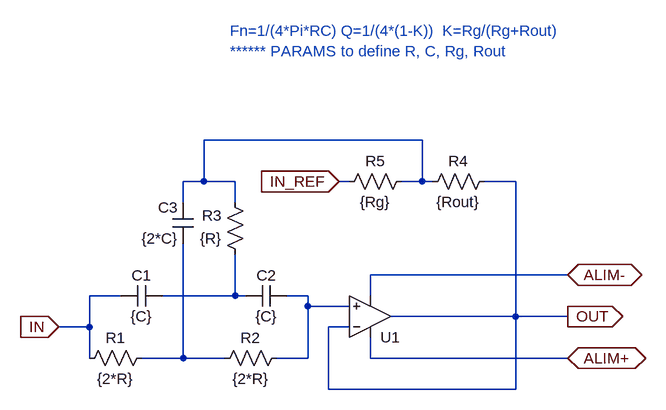
[diagram p0: schematic band-rejectTwinT-SUB.asc]
band-rejectTwinT-SUB.asc, the LTspice schematic file:
Version 4
SHEET 1 880 680
WIRE 160 -160 -176 -160
WIRE -176 -96 -176 -160
WIRE -176 -96 -208 -96
WIRE -128 -96 -176 -96
WIRE 48 -96 32 -96
WIRE 160 -96 160 -160
WIRE 160 -96 128 -96
WIRE 176 -96 160 -96
WIRE 304 -96 256 -96
WIRE -208 -64 -208 -96
WIRE -128 -64 -128 -96
WIRE 384 48 80 48
WIRE -304 80 -352 80
WIRE -128 80 -128 16
WIRE -128 80 -240 80
WIRE -112 80 -128 80
WIRE -16 80 -48 80
WIRE 80 80 80 48
WIRE -16 96 -16 80
WIRE 48 96 -16 96
WIRE 304 112 304 -96
WIRE 304 112 112 112
WIRE 384 112 304 112
WIRE -352 128 -352 80
WIRE -352 128 -400 128
WIRE 48 128 16 128
WIRE -352 176 -352 128
WIRE -208 176 -208 0
WIRE -208 176 -272 176
WIRE -144 176 -208 176
WIRE -16 176 -16 96
WIRE -16 176 -64 176
WIRE 80 176 80 144
WIRE 384 176 80 176
WIRE 16 224 16 128
WIRE 304 224 304 112
WIRE 304 224 16 224
FLAG 32 -96 IN_REF
IOPIN 32 -96 In
FLAG -400 128 IN
IOPIN -400 128 In
FLAG 384 48 ALIM-
IOPIN 384 48 BiDir
FLAG 384 112 OUT
IOPIN 384 112 Out
FLAG 384 176 ALIM+
IOPIN 384 176 BiDir
SYMBOL cap -240 64 R90
WINDOW 0 0 32 VBottom 2
WINDOW 3 32 32 VTop 2
SYMATTR InstName C1
SYMATTR Value {C}
SYMBOL cap -48 64 R90
WINDOW 0 0 32 VBottom 2
WINDOW 3 32 32 VTop 2
SYMATTR InstName C2
SYMATTR Value {C}
SYMBOL cap -192 0 R180
WINDOW 0 24 56 Left 2
WINDOW 3 24 8 Left 2
SYMATTR InstName C3
SYMATTR Value {2*C}
SYMBOL res -256 160 R90
WINDOW 0 0 56 VBottom 2
WINDOW 3 32 56 VTop 2
SYMATTR InstName R1
SYMATTR Value {2*R}
SYMBOL res -48 160 R90
WINDOW 0 0 56 VBottom 2
WINDOW 3 32 56 VTop 2
SYMATTR InstName R2
SYMATTR Value {2*R}
SYMBOL res -112 32 R180
WINDOW 0 36 76 Left 2
WINDOW 3 36 40 Left 2
SYMATTR InstName R3
SYMATTR Value {R}
SYMBOL Opamps\\UniversalOpamp2 80 112 M180
SYMATTR InstName U1
SYMATTR Value2 Avol=1Meg GBW=10Meg Slew=100Meg
SYMBOL res 272 -112 R90
WINDOW 0 0 56 VBottom 2
WINDOW 3 32 56 VTop 2
SYMATTR InstName R4
SYMATTR Value {Rout}
SYMBOL res 144 -112 R90
WINDOW 0 0 56 VBottom 2
WINDOW 3 32 56 VTop 2
SYMATTR InstName R5
SYMATTR Value {Rg}
TEXT -136 -328 Left 2 ;Fn=1/(4*Pi*RC) Q=1/(4*(1-K))  K=Rg/(Rg+Rout)\n****** PARAMS to define R, C, Rg, Rout

The netlist it stands for:
* band-rejectTwinT-SUB.asc
C1 N002 IN {C}
C2 N003 N002 {C}
C3 N004 N001 {2*C}
R1 N004 IN {2*R}
R2 N003 N004 {2*R}
R3 N002 N001 {R}
XU1 N003 OUT ALIM+ ALIM- OUT level.2 Avol=1Meg GBW=10Meg Slew=100Meg ilimit=25m rail=0 Vos=0 phimargin=45 en=0 enk=0 in=0 ink=0 Rin=500Meg  ; pins IN+ IN- V+ V- OUT
R4 OUT N001 {Rout}
R5 N001 IN_REF {Rg}
* Fn=1/(4*Pi*RC) Q=1/(4*(1-K))  K=Rg/(Rg+Rout)
* ****** PARAMS to define R, C, Rg, Rout
.lib UniversalOpamps2.sub
.backanno
.end